# Altium project link_logic.PrjPcb
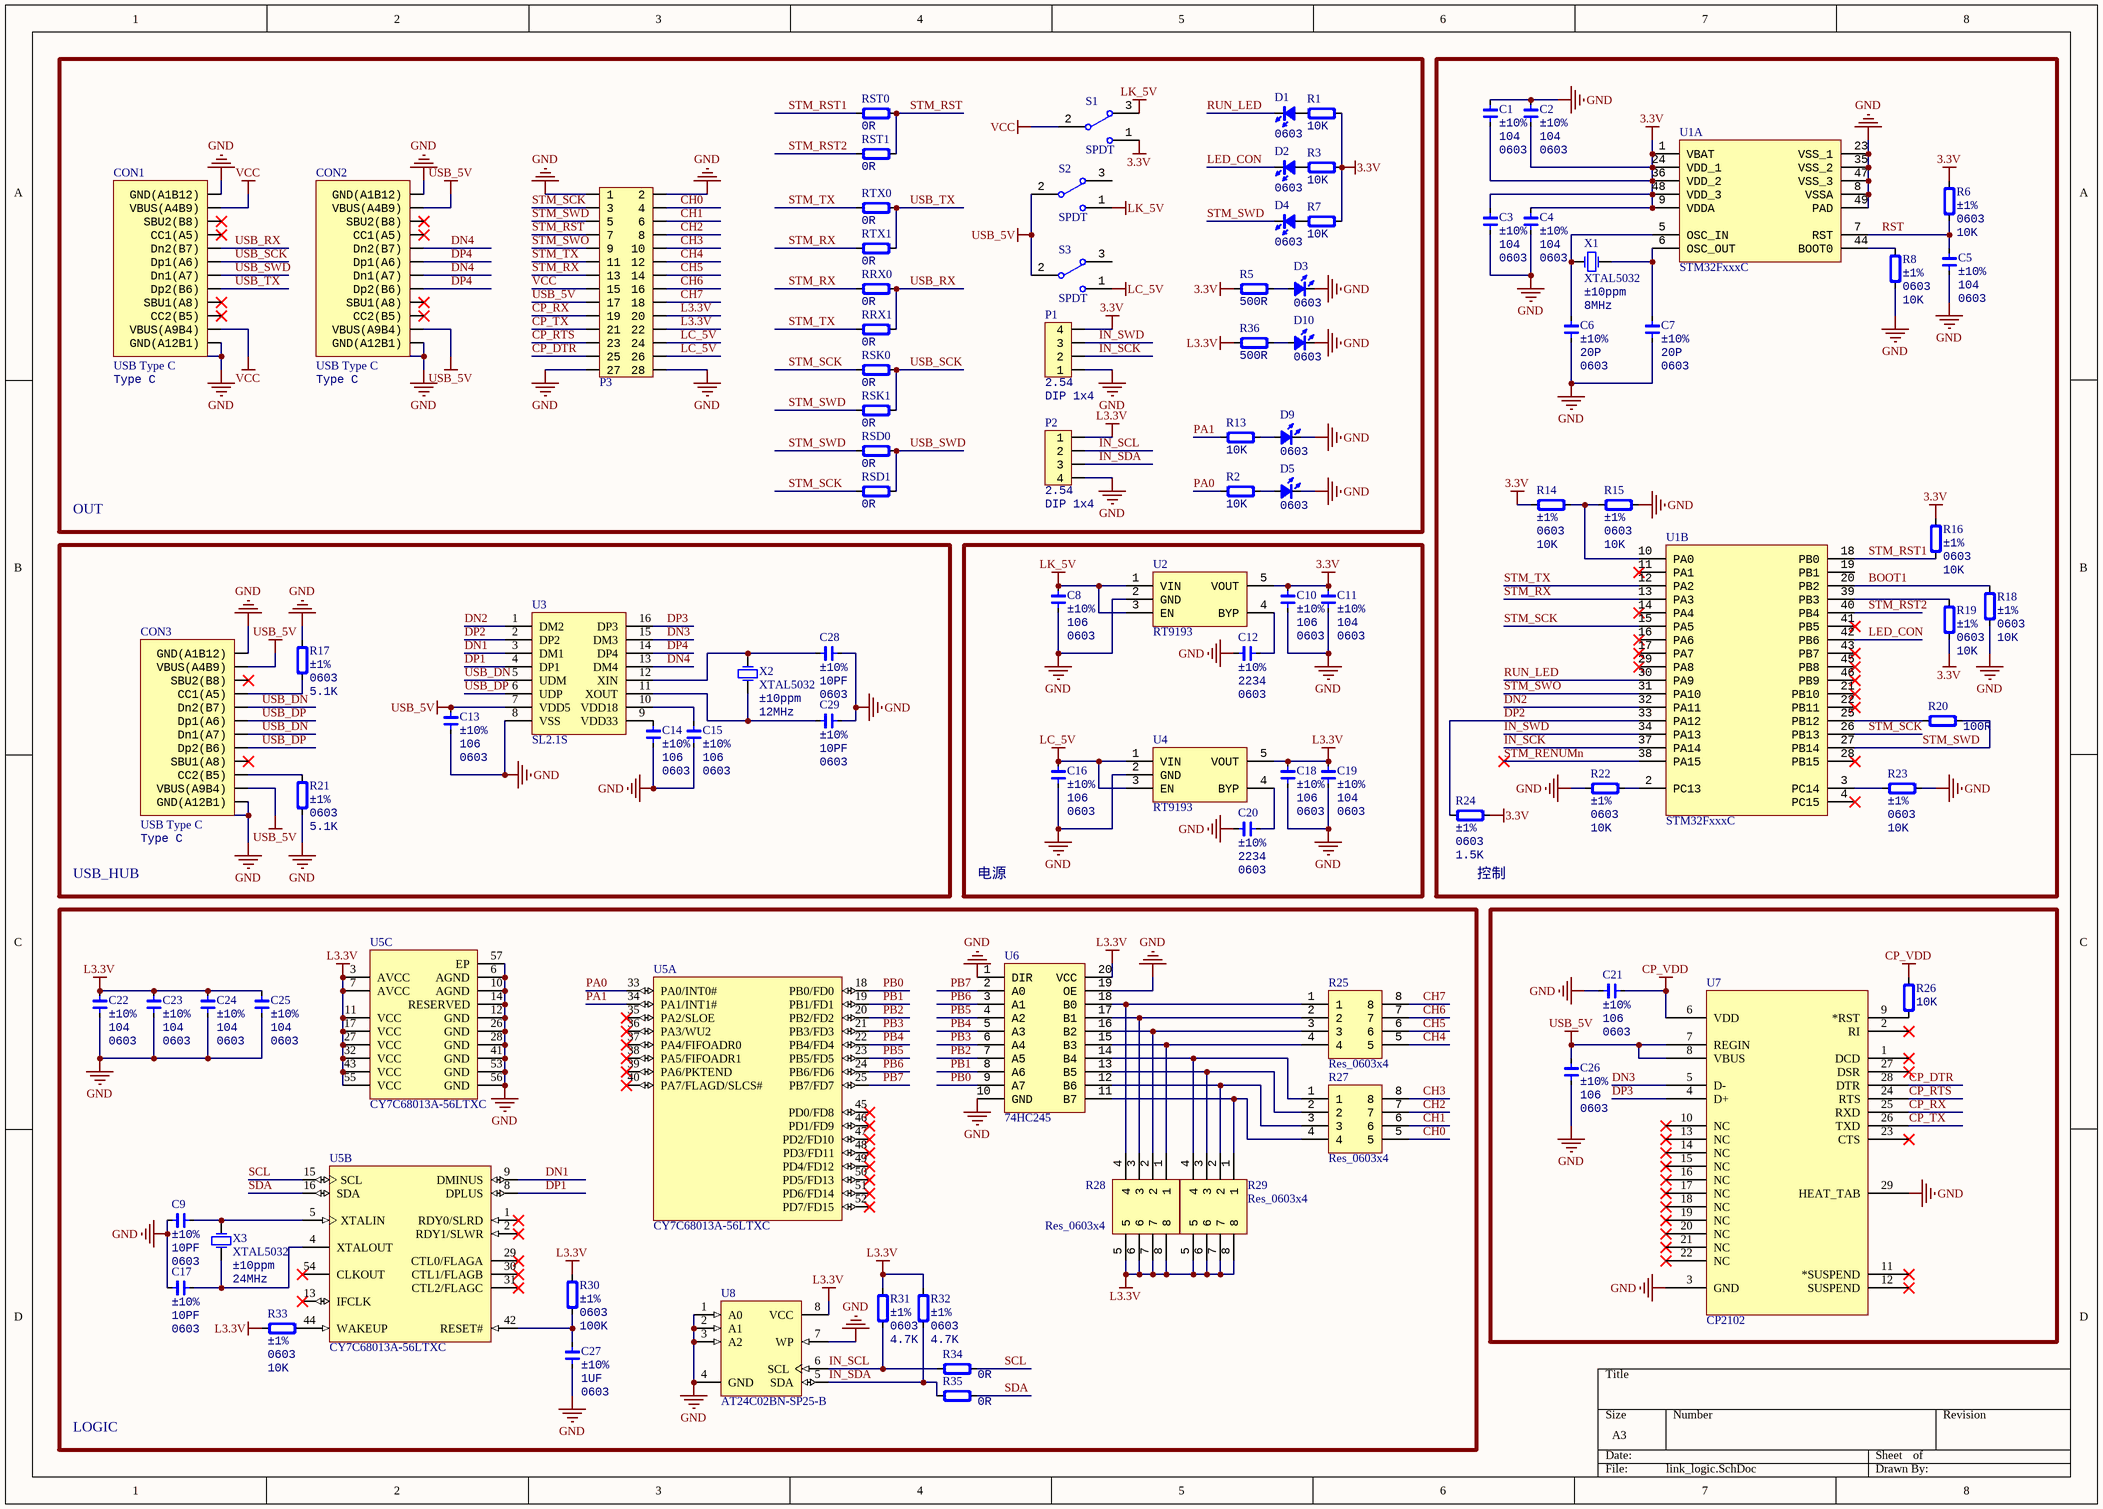
[diagram p0: link_logic.SchDoc]
1 sheet, 97 parts. Net scope: global (net labels, ports and power ports of the same name join across sheets).
Board files: link_logic.PcbDoc, cover.PcbDoc

## Sheet link_logic.SchDoc
size A3

### Parts
C1  value 104  Note: ±10%  Type: 0603  [CAP_0603]  (hidden comment: C0603)
C2  value 104  Note: ±10%  Type: 0603  [CAP_0603]  (hidden comment: C0603)
C3  value 104  Note: ±10%  Type: 0603  [CAP_0603]  (hidden comment: C0603)
C4  value 104  Note: ±10%  Type: 0603  [CAP_0603]  (hidden comment: C0603)
C5  value 104  Note: ±10%  Type: 0603  [CAP_0603]  (hidden comment: C0603)
C6  value 20P  Note: ±10%  Type: 0603  [CAP_0603]  (hidden comment: C0603)
C7  value 20P  Note: ±10%  Type: 0603  [CAP_0603]  (hidden comment: C0603)
C8  value 106  Note: ±10%  Type: 0603  [CAP_0603]  (hidden comment: C0603)
C9  value 10PF  Note: ±10%  Type: 0603  [CAP_0603]  (hidden comment: C0603)
C10  value 106  Note: ±10%  Type: 0603  [CAP_0603]  (hidden comment: C0603)
C11  value 104  Note: ±10%  Type: 0603  [CAP_0603]  (hidden comment: C0603)
C12  value 2234  Note: ±10%  Type: 0603  [CAP_0603]  (hidden comment: C0603)
C13  value 106  Note: ±10%  Type: 0603  [CAP_0603]  (hidden comment: C0603)
C14  value 106  Note: ±10%  Type: 0603  [CAP_0603]  (hidden comment: C0603)
C15  value 106  Note: ±10%  Type: 0603  [CAP_0603]  (hidden comment: C0603)
C16  value 106  Note: ±10%  Type: 0603  [CAP_0603]  (hidden comment: C0603)
C17  value 10PF  Note: ±10%  Type: 0603  [CAP_0603]  (hidden comment: C0603)
C18  value 106  Note: ±10%  Type: 0603  [CAP_0603]  (hidden comment: C0603)
C19  value 104  Note: ±10%  Type: 0603  [CAP_0603]  (hidden comment: C0603)
C20  value 2234  Note: ±10%  Type: 0603  [CAP_0603]  (hidden comment: C0603)
C21  value 106  Note: ±10%  Type: 0603  [CAP_0603]  (hidden comment: C0603)
C22  value 104  Note: ±10%  Type: 0603  [CAP_0603]  (hidden comment: C0603)
C23  value 104  Note: ±10%  Type: 0603  [CAP_0603]  (hidden comment: C0603)
C24  value 104  Note: ±10%  Type: 0603  [CAP_0603]  (hidden comment: C0603)
C25  value 104  Note: ±10%  Type: 0603  [CAP_0603]  (hidden comment: C0603)
C26  value 106  Note: ±10%  Type: 0603  [CAP_0603]  (hidden comment: C0603)
C27  value 1UF  Note: ±10%  Type: 0603  [CAP_0603]  (hidden comment: C0603)
C28  value 10PF  Note: ±10%  Type: 0603  [CAP_0603]  (hidden comment: C0603)
C29  value 10PF  Note: ±10%  Type: 0603  [CAP_0603]  (hidden comment: C0603)
CON1  USB Type C  value Type C  [TYPEC_16P_TOP]
CON2  USB Type C  value Type C  [TYPEC_16P_TOP]
CON3  USB Type C  value Type C  [TYPEC_16P_TOP]
D1  Type: 0603  [LED_0603_RED]  (hidden comment: D0603)
D2  Type: 0603  [LED_0603_RED]  (hidden comment: D0603)
D3  Type: 0603  [LED_0603_RED]  (hidden comment: D0603)
D4  Type: 0603  [LED_0603_RED]  (hidden comment: D0603)
D5  Type: 0603  [LED_0603_RED]  (hidden comment: D0603)
D9  Type: 0603  [LED_0603_RED]  (hidden comment: D0603)
D10  Type: 0603  [LED_0603_RED]  (hidden comment: D0603)
P1  value 2.54  Type: DIP 1x4  [HDR1X4_2.54_T]  (hidden comment: HDR1x4)
P2  value 2.54  Type: DIP 1x4  [HDR1X4_2.54_T]  (hidden comment: HDR1x4)
P3  HDR2x14_2.54TOP  [HDR2X14_2.54_T]  (value not drawn)
R1  value 10K  [RES_0603]  (hidden comment: R0603)
R2  value 10K  [RES_0603]  (hidden comment: R0603)
R3  value 10K  [RES_0603]  (hidden comment: R0603)
R5  value 500R  [RES_0603]  (hidden comment: R0603)
R6  value 10K  Note: ±1%  Type: 0603  [RES_0603]  (hidden comment: R0603)
R7  value 10K  [RES_0603]  (hidden comment: R0603)
R8  value 10K  Note: ±1%  Type: 0603  [RES_0603]  (hidden comment: R0603)
R13  value 10K  [RES_0603]  (hidden comment: R0603)
R14  value 10K  Note: ±1%  Type: 0603  [RES_0603]  (hidden comment: R0603)
R15  value 10K  Note: ±1%  Type: 0603  [RES_0603]  (hidden comment: R0603)
R16  value 10K  Note: ±1%  Type: 0603  [RES_0603]  (hidden comment: R0603)
R17  value 5.1K  Note: ±1%  Type: 0603  [RES_0603]  (hidden comment: R0603)
R18  value 10K  Note: ±1%  Type: 0603  [RES_0603]  (hidden comment: R0603)
R19  value 10K  Note: ±1%  Type: 0603  [RES_0603]  (hidden comment: R0603)
R20  value 100R  [RES_0603]  (hidden comment: R0603)
R21  value 5.1K  Note: ±1%  Type: 0603  [RES_0603]  (hidden comment: R0603)
R22  value 10K  Note: ±1%  Type: 0603  [RES_0603]  (hidden comment: R0603)
R23  value 10K  Note: ±1%  Type: 0603  [RES_0603]  (hidden comment: R0603)
R24  value 1.5K  Note: ±1%  Type: 0603  [RES_0603]  (hidden comment: R0603)
R25  Res_0603x4  [RES_0603X4]
R26  value 10K  [RES_0603]  (hidden comment: R0603)
R27  Res_0603x4  [RES_0603X4]
R28  Res_0603x4  [RES_0603X4]
R29  Res_0603x4  [RES_0603X4]
R30  value 100K  Note: ±1%  Type: 0603  [RES_0603]  (hidden comment: R0603)
R31  value 4.7K  Note: ±1%  Type: 0603  [RES_0603]  (hidden comment: R0603)
R32  value 4.7K  Note: ±1%  Type: 0603  [RES_0603]  (hidden comment: R0603)
R33  value 10K  Note: ±1%  Type: 0603  [RES_0603]  (hidden comment: R0603)
R34  value 0R  [RES_0603]  (hidden comment: R0603)
R35  value 0R  [RES_0603]  (hidden comment: R0603)
R36  value 500R  [RES_0603]  (hidden comment: R0603)
RRX0  value 0R  [RES_0603]  (hidden comment: R0603)
RRX1  value 0R  [RES_0603]  (hidden comment: R0603)
RSD0  value 0R  [RES_0603]  (hidden comment: R0603)
RSD1  value 0R  [RES_0603]  (hidden comment: R0603)
RSK0  value 0R  [RES_0603]  (hidden comment: R0603)
RSK1  value 0R  [RES_0603]  (hidden comment: R0603)
RST0  value 0R  [RES_0603]  (hidden comment: R0603)
RST1  value 0R  [RES_0603]  (hidden comment: R0603)
RTX0  value 0R  [RES_0603]  (hidden comment: R0603)
RTX1  value 0R  [RES_0603]  (hidden comment: R0603)
S1  SPDT  [SwitchSPDT_2.8X6.6_90]
S2  SPDT  [SwitchSPDT_2.8X6.6_90]
S3  SPDT  [SwitchSPDT_2.8X6.6_90]
U1  STM32FxxxC  [LQFP_QNF_48]  (parts A,B of 2)
U2  RT9193  [SOT23-5]
U3  SL2.1S  [TSSOP16]
U4  RT9193  [SOT23-5]
U5  CY7C68013A-56LTXC  [CYP-LTX56-5200X4500TP_N]  (parts A,B,C of 3)
U6  74HC245  [SOP_E300_20]
U7  CP2102  [QFN-28]
U8  AT24C02BN-SP25-B  [8S1_N]
X1  XTAL5032  value 8MHz  Specification: ±10ppm  [XT_5032_2]
X2  XTAL5032  value 12MHz  Specification: ±10ppm  [XT_5032_2]
X3  XTAL5032  value 24MHz  Specification: ±10ppm  [XT_5032_2]

### Blocks framed on the sheet
OUT: CON1 CON2 D1-D5 D9 D10 P1-P3 R1-R3 R5 R7 R13 R36 RRX0 RRX1 RSD0 RSD1 RSK0 RSK1 RST0 RST1 RTX0 RTX1 S1-S3
控制: C1-C7 R6 R8 R14-R16 R18-R20 R22-R24 U1 X1
USB_HUB: C13-C15 C28 C29 CON3 R17 R21 U3 X2
电源: C8 C10-C12 C16 C18-C20 U2 U4
LOGIC: C9 C17 C22-C25 C27 R25 R27-R35 U5 U6 U8 X3

### Nets
3.3V: C1.1 C2.1 C3.2 C4.2 C10.2 C11.2 P1.4 R1.1 R3.1 R5.1 R6.2 R7.1 R14.2 R16.2 R19.2 R24.2 S1.1 U1.1(VBAT) U1.9(VDDA) U1.24(VDD_1) U1.36(VDD_2) U1.48(VDD_3) U2.5(VOUT)
CP_VDD: C21.2 R26.2 U7.6(VDD)
GND: C1.2 C2.2 C3.1 C4.1 C5.1 C6.1 C7.1 C8.1 C9.2 C10.1 C11.1 C12.1 C13.1 C14.2 C15.2 C16.1 C17.2 C18.1 C19.1 C20.1 C21.1 C22.2 C23.2 C24.2 C25.2 C26.1 C27.1 C28.2 C29.2 CON1.0(SH) CON1.A1B12(GND(A1B12)) CON1.A12B1(GND(A12B1)) CON2.0(SH) CON2.A1B12(GND(A1B12)) CON2.A12B1(GND(A12B1)) CON3.0(SH) CON3.A1B12(GND(A1B12)) CON3.A12B1(GND(A12B1)) D3.2(K) D5.2(K) D9.2(K) D10.2(K) P1.1 P2.4 P3.1 P3.2 P3.27 P3.28 R8.1 R15.1 R17.2 R18.2 R21.1 R22.1 R23.2 U1.8(VSSA) U1.23(VSS_1) U1.35(VSS_2) U1.47(VSS_3) U1.49(PAD) U2.2(GND) U3.8(VSS) U4.2(GND) U5.6(AGND) U5.10(AGND) U5.12(GND) U5.14(RESERVED) U5.26(GND) U5.28(GND) U5.41(GND) U5.53(GND) U5.56(GND) U5.57(EP) U6.1(DIR) U6.10(GND) U6.19(OE) U7.3(GND) U7.29(HEAT_TAB) U8.1(A0) U8.2(A1) U8.3(A2) U8.4(GND) U8.7(WP)
L3.3V: C18.2 C19.2 C22.1 C23.1 C24.1 C25.1 P2.1 P3.20 P3.22 R28.5 R28.6 R28.7 R28.8 R29.5 R29.6 R29.7 R29.8 R30.2 R31.2 R32.1 R33.2 R36.1 U4.5(VOUT) U5.3(AVCC) U5.7(AVCC) U5.11(VCC) U5.17(VCC) U5.27(VCC) U5.32(VCC) U5.43(VCC) U5.55(VCC) U6.20(VCC) U8.8(VCC)
LC_5V: C16.2 P3.24 P3.26 S3.1 U4.1(VIN) U4.3(EN)
LK_5V: C8.2 S1.3 S2.1 U2.1(VIN) U2.3(EN)
USB_5V: C13.2 C26.2 CON2.A4B9(VBUS(A4B9)) CON2.A9B4(VBUS(A9B4)) CON3.A4B9(VBUS(A4B9)) CON3.A9B4(VBUS(A9B4)) P3.17 S2.2 S3.2 U3.7(VDD5) U7.7(REGIN) U7.8(VBUS)
VCC: CON1.A4B9(VBUS(A4B9)) CON1.A9B4(VBUS(A9B4)) P3.15 S1.2
BOOT1: R18.1 U1.20(PB2)
CH0: P3.4 R27.5
CH1: P3.6 R27.6
CH2: P3.8 R27.7
CH3: P3.10 R27.8
CH4: P3.12 R25.5
CH5: P3.14 R25.6
CH6: P3.16 R25.7
CH7: P3.18 R25.8
CP_DTR: P3.25 U7.28(DTR)
CP_RTS: P3.23 U7.24(RTS)
CP_RX: P3.19 U7.25(RXD)
CP_TX: P3.21 U7.26(TXD)
DN1: U3.3(DM1) U5.9(DMINUS)
DN2: U1.32(PA11) U3.1(DM2)
DN3: U3.15(DM3) U7.5(D-)
DN4: CON2.A7(Dn1(A7)) CON2.B7(Dn2(B7)) U3.13(DM4)
DP1: U3.4(DP1) U5.8(DPLUS)
DP2: R24.1 U1.33(PA12) U3.2(DP2)
DP3: U3.16(DP3) U7.4(D+)
DP4: CON2.A6(Dp1(A6)) CON2.B6(Dp2(B6)) U3.14(DP4)
IN_SCK: P1.2 U1.37(PA14)
IN_SCL: P2.2 R31.1 R34.2 U8.6(SCL)
IN_SDA: P2.3 R32.2 R35.2 U8.5(SDA)
IN_SWD: P1.3 U1.34(PA13)
LED_CON: D2.2(K) U1.42(PB6)
PA0: R2.2 U5.33(PA0/INT0#)
PA1: R13.2 U5.34(PA1/INT1#)
PB0: U5.18(PB0/FD0) U6.9(A7)
PB1: U5.19(PB1/FD1) U6.8(A6)
PB2: U5.20(PB2/FD2) U6.7(A5)
PB3: U5.21(PB3/FD3) U6.6(A4)
PB4: U5.22(PB4/FD4) U6.5(A3)
PB5: U5.23(PB5/FD5) U6.4(A2)
PB6: U5.24(PB6/FD6) U6.3(A1)
PB7: U5.25(PB7/FD7) U6.2(A0)
RST: C5.2 R6.1 U1.7(RST)
RUN_LED: D1.2(K) U1.30(PA9)
SCL: R34.1 U5.15(SCL)
SDA: R35.1 U5.16(SDA)
STM_RENUMn: U1.38(PA15)
STM_RST: P3.7 RST0.1 RST1.1
STM_RST1: R16.1 RST0.2 U1.18(PB0)
STM_RST2: RST1.2 U1.40(PB4)
STM_RX: P3.13 RRX0.2 RTX1.2 U1.13(PA3)
STM_SCK: P3.3 RSD1.2 RSK0.2 U1.15(PA5) U1.26(PB13)
STM_SWD: D4.2(K) P3.5 R20.1 RSD0.2 RSK1.2 U1.27(PB14)
STM_SWO: P3.9 U1.31(PA10)
STM_TX: P3.11 RRX1.2 RTX0.2 U1.12(PA2)
USB_DN: CON3.A7(Dn1(A7)) CON3.B7(Dn2(B7)) U3.5(UDM)
USB_DP: CON3.A6(Dp1(A6)) CON3.B6(Dp2(B6)) U3.6(UDP)
USB_RX: CON1.B7(Dn2(B7)) RRX0.1 RRX1.1
USB_SCK: CON1.A6(Dp1(A6)) RSK0.1 RSK1.1
USB_SWD: CON1.A7(Dn1(A7)) RSD0.1 RSD1.1
USB_TX: CON1.B6(Dp2(B6)) RTX0.1 RTX1.1
NetC6_2: C6.2 U1.5(OSC_IN) X1.1(OSC1)
NetC7_2: C7.2 U1.6(OSC_OUT) X1.2(OSC2)
NetC9_1: C9.1 U5.5(XTALIN) X3.1(OSC1)
NetC12_2: C12.2 U2.4(BYP)
NetC14_1: C14.1 U3.9(VDD33)
NetC15_1: C15.1 U3.10(VDD18)
NetC17_1: C17.1 U5.4(XTALOUT) X3.2(OSC2)
NetC20_2: C20.2 U4.4(BYP)
NetC27_2: C27.2 R30.1 U5.42(RESET#)
NetC28_1: C28.1 U3.12(XIN) X2.2(OSC2)
NetC29_1: C29.1 U3.11(XOUT) X2.1(OSC1)
NetCON3_A5: CON3.A5(CC1(A5)) R17.1
NetCON3_B5: CON3.B5(CC2(B5)) R21.2
NetD1_1: D1.1(A) R1.2
NetD2_1: D2.1(A) R3.2
NetD3_1: D3.1(A) R5.2
NetD4_1: D4.1(A) R7.2
NetD5_1: D5.1(A) R2.1
NetD9_1: D9.1(A) R13.1
NetD10_1: D10.1(A) R36.2
NetR8_2: R8.2 U1.44(BOOT0)
NetR14_1: R14.1 R15.2 U1.10(PA0)
NetR19_1: R19.1 U1.39(PB3)
NetR20_2: R20.2 U1.25(PB12)
NetR22_2: R22.2 U1.2(PC13)
NetR23_1: R23.1 U1.3(PC14)
NetR25_1: R25.1 R28.4 U6.18(B0)
NetR25_2: R25.2 R28.3 U6.17(B1)
NetR25_3: R25.3 R28.2 U6.16(B2)
NetR25_4: R25.4 R28.1 U6.15(B3)
NetR26_1: R26.1 U7.9(*RST)
NetR27_1: R27.1 R29.4 U6.14(B4)
NetR27_2: R27.2 R29.3 U6.13(B5)
NetR27_3: R27.3 R29.2 U6.12(B6)
NetR27_4: R27.4 R29.1 U6.11(B7)
NetR33_1: R33.1 U5.44(WAKEUP)

Not connected (* = marked no-connect by the designer): CON1 A5(CC1(A5))* A8(SBU1(A8))* B5(CC2(B5))* B8(SBU2(B8))*; CON2 A5(CC1(A5))* A8(SBU1(A8))* B5(CC2(B5))* B8(SBU2(B8))*; CON3 A8(SBU1(A8))* B8(SBU2(B8))*; S2 3; S3 3; U1 4(PC15)* 11(PA1)* 14(PA4)* 16(PA6)* 17(PA7)* 19(PB1) 21(PB10)* 22(PB11)* 28(PB15)* 29(PA8)* 41(PB5)* 43(PB7)* 45(PB8)* 46(PB9)*; U5 1(RDY0/SLRD)* 2(RDY1/SLWR)* 13(IFCLK)* 29(CTL0/FLAGA)* 30(CTL1/FLAGB)* 31(CTL2/FLAGC)* 35(PA2/SLOE)* 36(PA3/WU2)* 37(PA4/FIFOADR0)* 38(PA5/FIFOADR1)* 39(PA6/PKTEND)* 40(PA7/FLAGD/SLCS#)* 45(PD0/FD8)* 46(PD1/FD9)* 47(PD2/FD10)* 48(PD3/FD11)* 49(PD4/FD12)* 50(PD5/FD13)* 51(PD6/FD14)* 52(PD7/FD15)* 54(CLKOUT)*; U7 1(DCD)* 2(RI)* 10(NC)* 11(*SUSPEND)* 12(SUSPEND)* 13(NC)* 14(NC)* 15(NC)* 16(NC)* 17(NC)* 18(NC)* 19(NC)* 20(NC)* 21(NC)* 22(NC)* 23(CTS)* 27(DSR)*

### Library data of the parts
C1-C29 = Cap_0603: Capacitor; Specification: X7R, ±10%, 16V; Manufacturer: *
CON1-CON3 = USB_TypeC_16P: USB; Type: *
D1-D5 D9 D10 = LED_0603: LED; Value: color?; Manufacturer: *; Specification: *; Note: *
P1 P2 = HDR1x4_2.54TOP: Header Top
P3 = HDR2x14_2.54TOP: Header Top
R1-R3 R5 R7 R13 R20 R26 R34-R36 RRX0 RRX1 RSD0 RSD1 RSK0 RSK1 RST0 RST1 RTX0 RTX1 = Res_0603: Resistor; Specification: ±1%; Manufacturer: *; Note: ±1%; Type: 0603
R6 R8 R14-R19 R21-R24 R30-R33 = Res_0603: Resistor; Manufacturer: *; Specification: ±1%
R25 R27-R29 = Res_0603x4: Resistor
S1-S3 = SwitchSPDT_90_2.8x6.6: Switch; Value: 2.8x6.6mm; Type: SPDT 3P; Link: *
U1 = STM32FxxxC: MCU ST; Manufacturer: STMicroelectronics; Note: CortexM3; Type: LQFP48 P0.5; Specification: *; Value: *
U2 U4 = RT9193: Power; Value: 3V3; Type: SOT23-5; Manufacturer: *; Specification: *; Note: *
U3 = SL2.1S: USB HUB
U5 = CY7C68013A-56LTXC: EZ-USB(R) FX2LP(TM) USB Microcontroller High-Speed USB Peripheral Controller, 16 KB, 24 I/Os, 3 to 3.6 V, 0 to 70 degC, 56-Pin QFN (LTX56), Tray; Manufacturer: Cypress; Max. Operating Voltage (V): 3.6; Memory Architecture: RAM; Memory Size (KB): 16; Min. Operating Voltage (V): 3; No. of I/Os: 24; DatasheetVersion: Rev. *W; PackageVersion: Rev. *D; PackageReference: LTX56; PackageDescription: 56-Pin Sawn QFN, Body 8 x 8 mm, Pitch 0.5 mm; Supplier 1: Digi-Key; Supplier Part Number 1: 428-2933-ND; Supplier 2: Newark; Supplier Part Number 2: 50R9455; Supplier 3: Mouser; Supplier Part Number 3: 727-CY7C68013A56LTXC; CPU Core: Enhanced 8051; Max. Operating Temp. (degreesC): 70; Min. Operating Temp. (degreesC): 0; Packing: Tray; RoHS: Pb-Free; Mounting Technology: Surface Mount; Code_JEDEC: MO-220; PartNumber: CY7C68013A-56LTXC; ComponentLink1Description: Manufacturer URL; ComponentLink1URL: http://www.cypress.com/; ComponentLink2Description: Datasheet; ComponentLink2URL: http://www.cypress.com/?docID=45142; ComponentLink3Description: Package Specification; ComponentLink3URL: http://www.cypress.com/?docID=47572
U6 = 74HC245: 74 Series; Type: *
U8 = AT24C02BN-SP25-B: 2Kbit (256 x 8), 2-wire Bus Automotive Serial EEPROM with full memory Write Protect, 2.5V, 8-Pin SOIC, Bulk; DatasheetVersion: 8517C,  Jan-2009; PackageVersion: revC, Mar-2005; PackageReference: 8S1; PackageDescription: 8-Lead (0.150" Wide Body), Plastic Gull Wing Small Outline (JEDEC SOIC); Code_JEDEC: MS-012-AA; Code_IPC: SOIC127P600-8; ComponentLink1Description: Manufacturer URL; ComponentLink1URL: http://www.atmel.com/; ComponentLink2Description: Datasheet; ComponentLink2URL: http://www.atmel.com/dyn/resources/prod_documents/doc8517.pdf
X1-X3 = XTAL_5032_2P: Crystal Oscillator; Type: XTAL5032_2P; Manufacturer: *; Note: *